# EAGLE design Irdroid-Rpi (EAGLE 6.5.0)
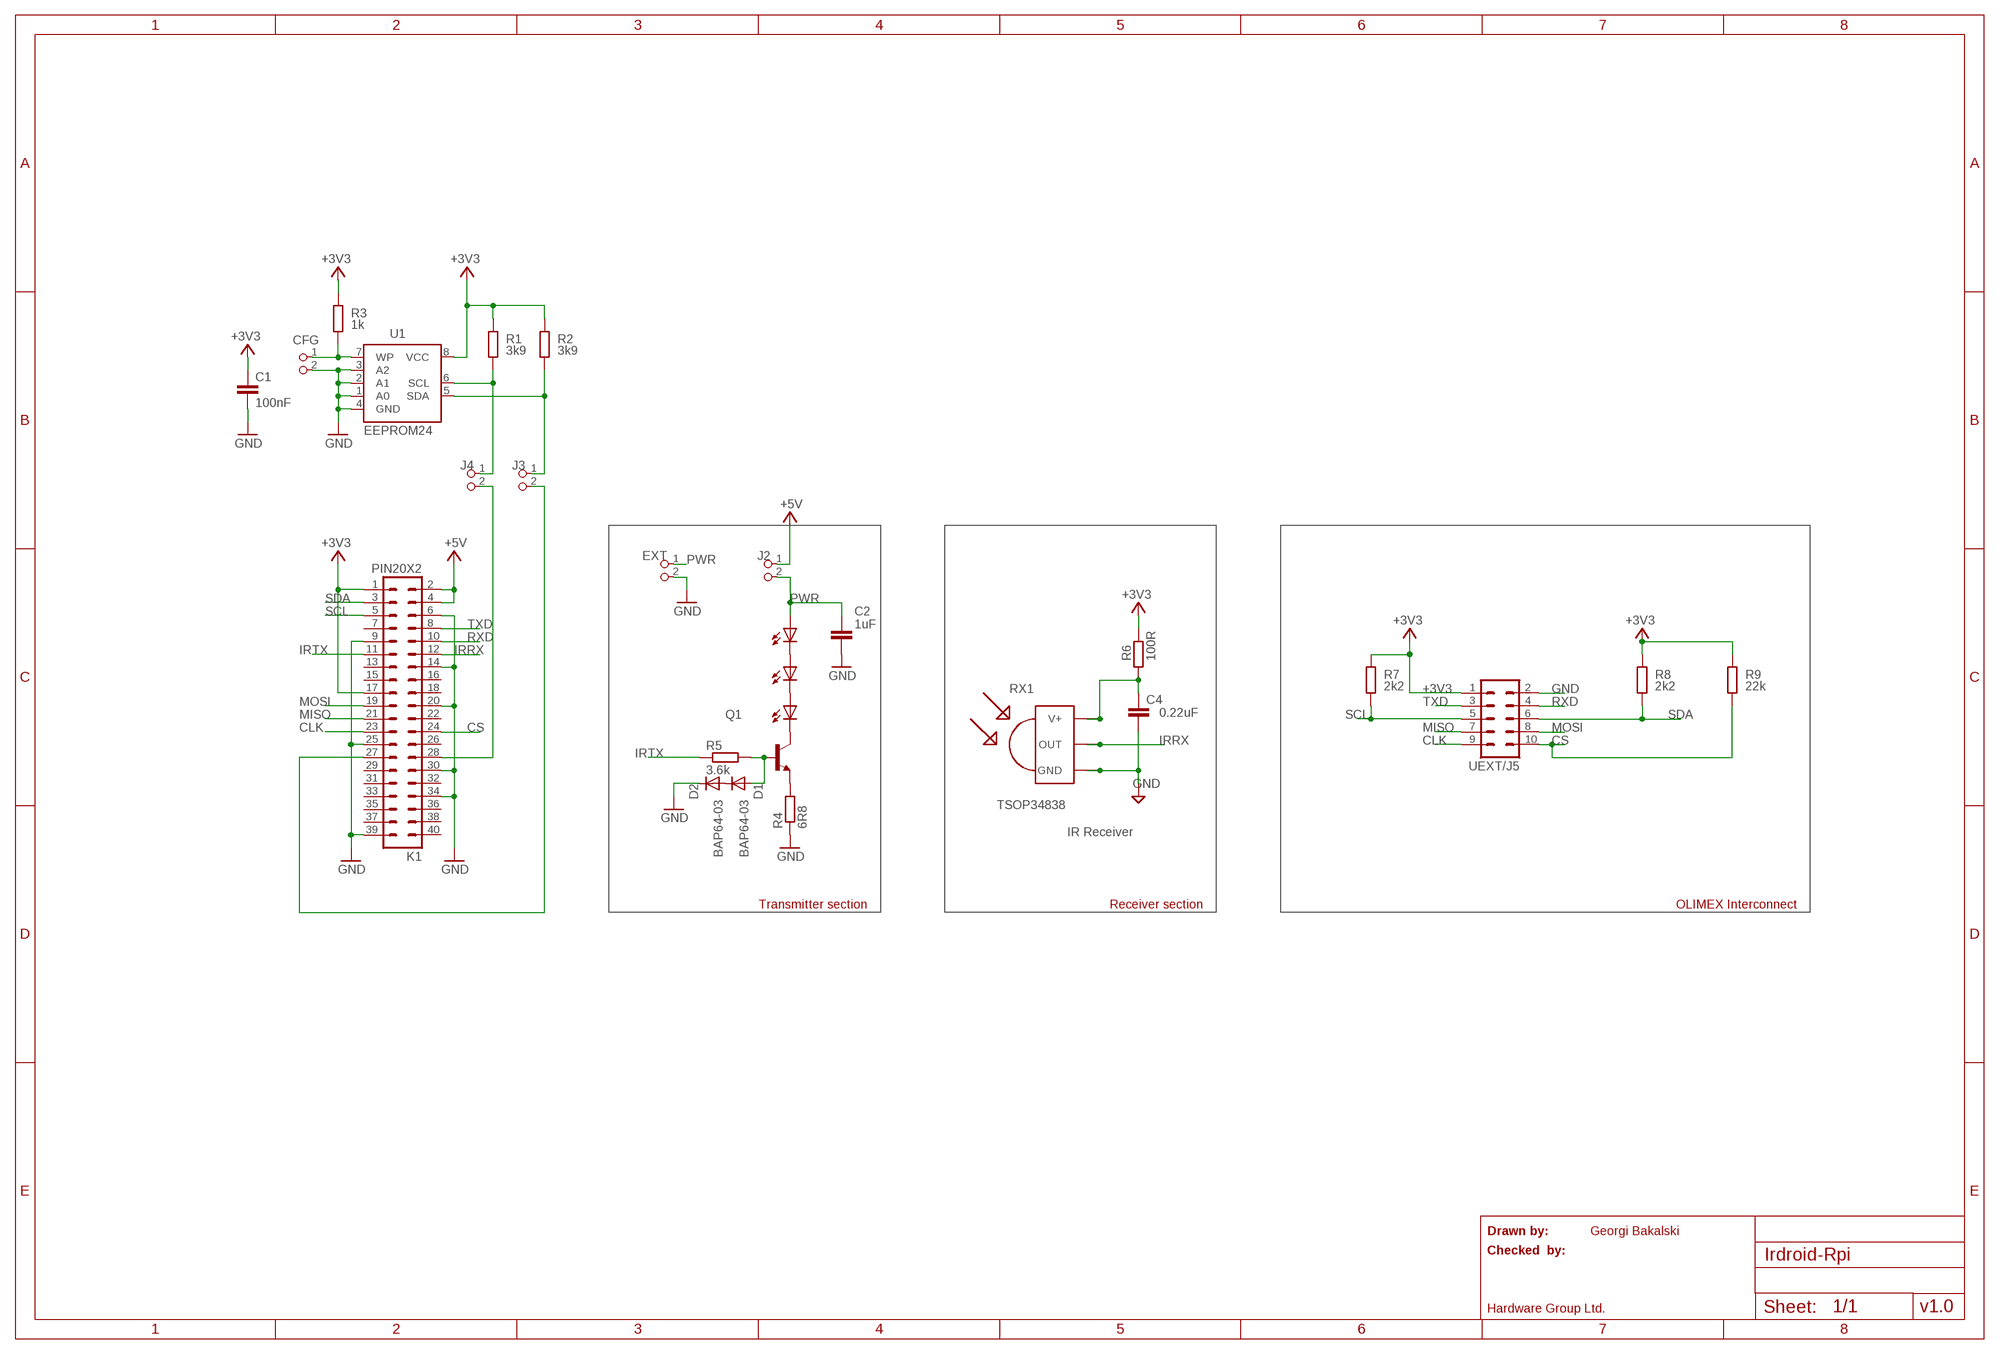
[diagram p0: schematic, sheet 1]

## Parts
C1  100nF  C-EUC0805K  [C0805K]
C2  1uF  CAPACITOR_NPOL-0603  [C603@1]
C4  0.22uF  CAPC603  [C603]
CFG  PIN2_100  [PIN_W_2]
D1  BAP64-03  DIODE-DO323  [DO323]
D2  BAP64-03  DIODE-DO323  [DO323]
EXT  PIN2_100  [PIN_W_2]
J2  PIN2_100  [PIN_W_2]
J3  PIN2_100  [PIN_W_2]
J4  PIN2_100  [PIN_W_2]
K1  PIN20X2  [PIN_20X2]
Q1  TRANSISTOR_BJT_NPN-SOT-23-BCE  [SOT-23]
R1  3k9  R-EU_M0805  [M0805]
R2  3k9  R-EU_M0805  [M0805]
R3  1k  R-EU_M0805  [M0805]
R4  6R8  R-EU_R1206  [R1206]
R5  3.6k  R-EU_R0603  [R0603]
R6  100R  RESISTORR603  [R603]
R7  2k2  R-EU_M0805  [M0805]
R8  2k2  R-EU_M0805  [M0805]
R9  22k  R-EU_M0805  [M0805]
RX1  TSOP34838  TSOP4838  [TSOP18XX]
U1  EEPROM24  [SOIC8]
U$5  IRLED5MM  [IRLED_HOLDER]
U$6  IRLED5MM  [IRLED_HOLDER]
U$7  IRLED5MM  [IRLED_HOLDER]
UEXT/J5  ML10  [ML10]

## Nets
+3V3: C1.1 K1.1 K1.17 R1.2 R2.2 R3.2 R6.2 R7.2 R8.2 R9.2 U1.8(VCC) UEXT/J5.1
+5V: J2.1 K1.2 K1.4
CLK: K1.23 UEXT/J5.9
CS: K1.24 R9.1 UEXT/J5.10
GND: C1.2 C2.2 C4.2 CFG.2 D2.C EXT.2 K1.6 K1.9 K1.14 K1.20 K1.25 K1.30 K1.34 K1.39 R4.1 RX1.GND U1.1(A0) U1.2(A1) U1.3(A2) U1.4(GND) UEXT/J5.2
IRRX: K1.12 RX1.OUT
IRTX: K1.11 R5.1
MISO: K1.21 UEXT/J5.7
MOSI: K1.19 UEXT/J5.8
N$1: J4.2 K1.28
N$2: J3.2 K1.27
N$3: CFG.1 R3.1 U1.7(WP)
N$4: Q1.3(E) R4.2
N$5: Q1.2(C) U$5.K(C)
N$6: U$5.A U$6.K(C)
N$7: U$6.A U$7.K(C)
N$8: D1.A Q1.1(B) R5.2
N$9: D1.C D2.A
N$10: C4.1 R6.1 RX1.VCC(V+)
N$12: J4.1 R1.1 U1.6(SCL)
N$13: J3.1 R2.1 U1.5(SDA)
PWR: C2.1 EXT.1 J2.2 U$7.A
RXD: K1.10 UEXT/J5.4
SCL: K1.5 R7.1 UEXT/J5.5
SDA: K1.3 R8.1 UEXT/J5.6
TXD: K1.8 UEXT/J5.3
Unconnected: K1.7 K1.13 K1.15 K1.16 K1.18 K1.22 K1.26 K1.29 K1.31 K1.32 K1.33 K1.35 K1.36 K1.37 K1.38 K1.40

## Notes on the sheet
- RX1
- TSOP34838
- IR Receiver
- Transmitter section | Receiver section | OLIMEX Interconnect
- Drawn by: | Georgi Bakalski
- Checked  by:
- Hardware Group Ltd. | v1.0

## Library data of the parts
C1 = resistor:C-EU: CAPACITOR, European symbol; DIELECTRIC: X7R
C2 = dp_devices:CAPACITOR_NPOL: Non-Polarized capacitor in various packages
C4 = dp_devices:CAP
CFG EXT J2-J4 = FLYFISH:PIN2
D1 D2 = dp_devices:DIODE: Various Diode Packages
K1 = FLYFISH:PIN20X2
Q1 = dp_devices:TRANSISTOR_BJT_NPN: Most commonly used is SOT23-BEC
R1-R3 R7-R9 = resistor:R-EU_: RESISTOR, European symbol; TOLERANCE: 5%
R4 R5 = resistor:R-EU_: RESISTOR, European symbol
R6 = dp_devices:RESISTOR
RX1 = tsop:TSOP4838: IR Receiver and Demodulator
U1 = FLYFISH:EEPROM24
U$5-U$7 = IRLED_holder:IRLED5MM
UEXT/J5 = con-harting-ml:ML10: HARTING

## Board
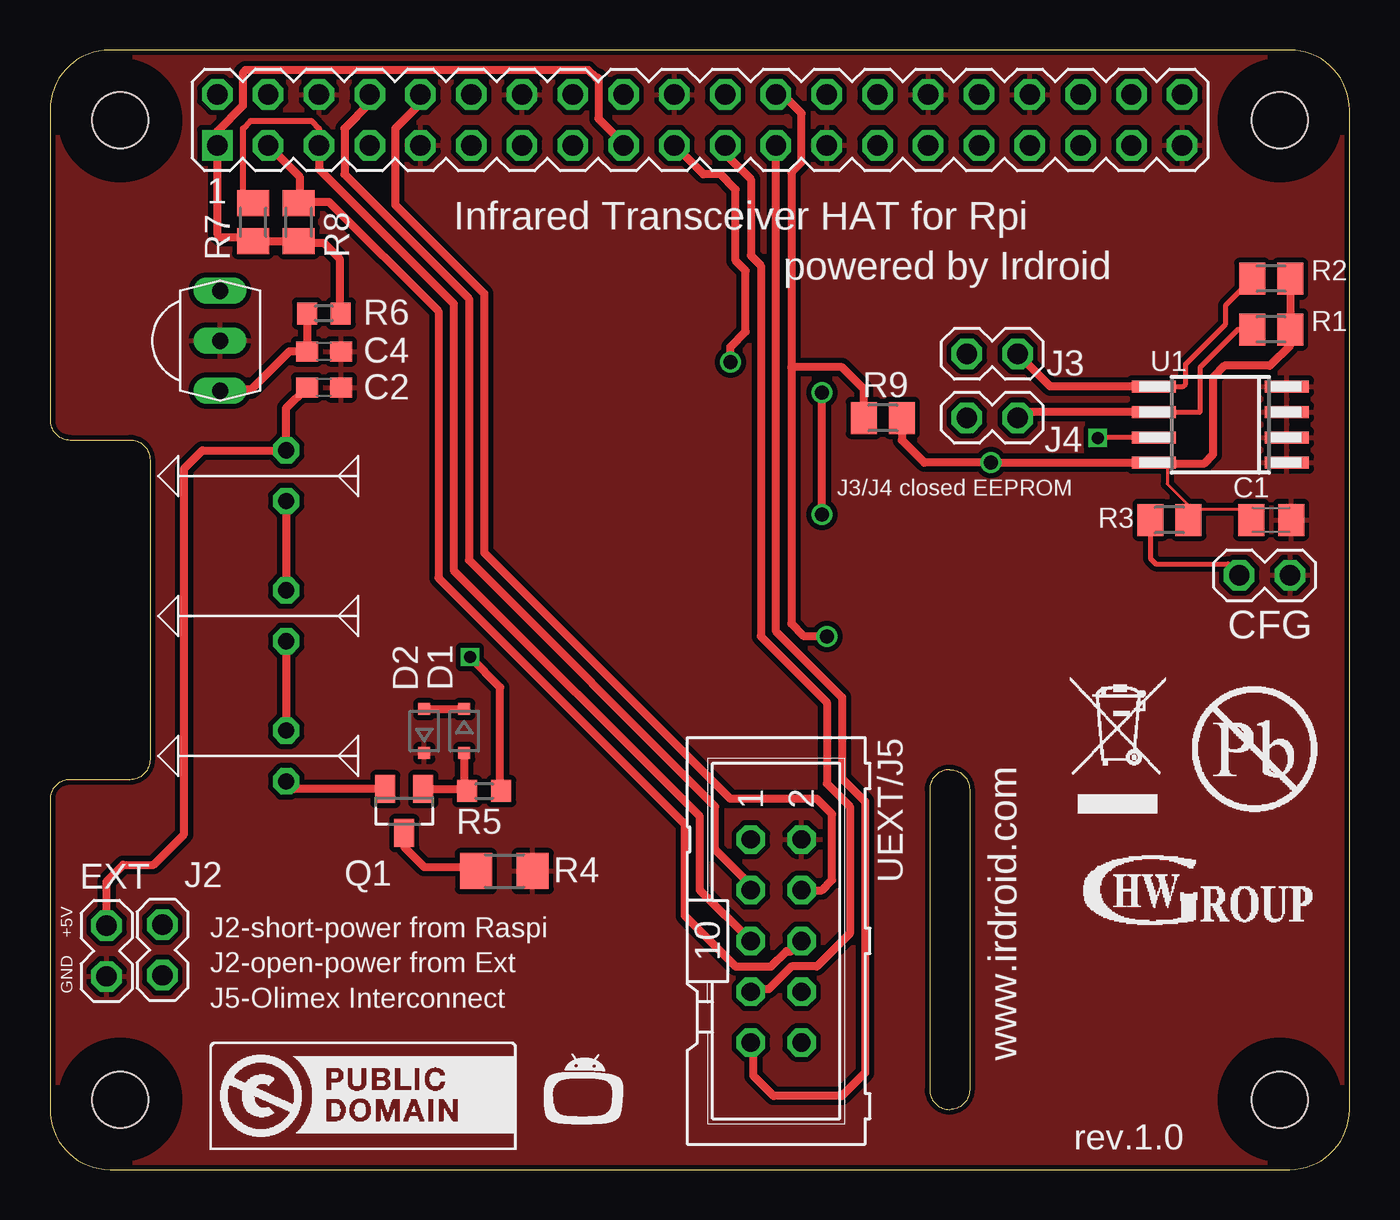
[diagram p1: board, top side]
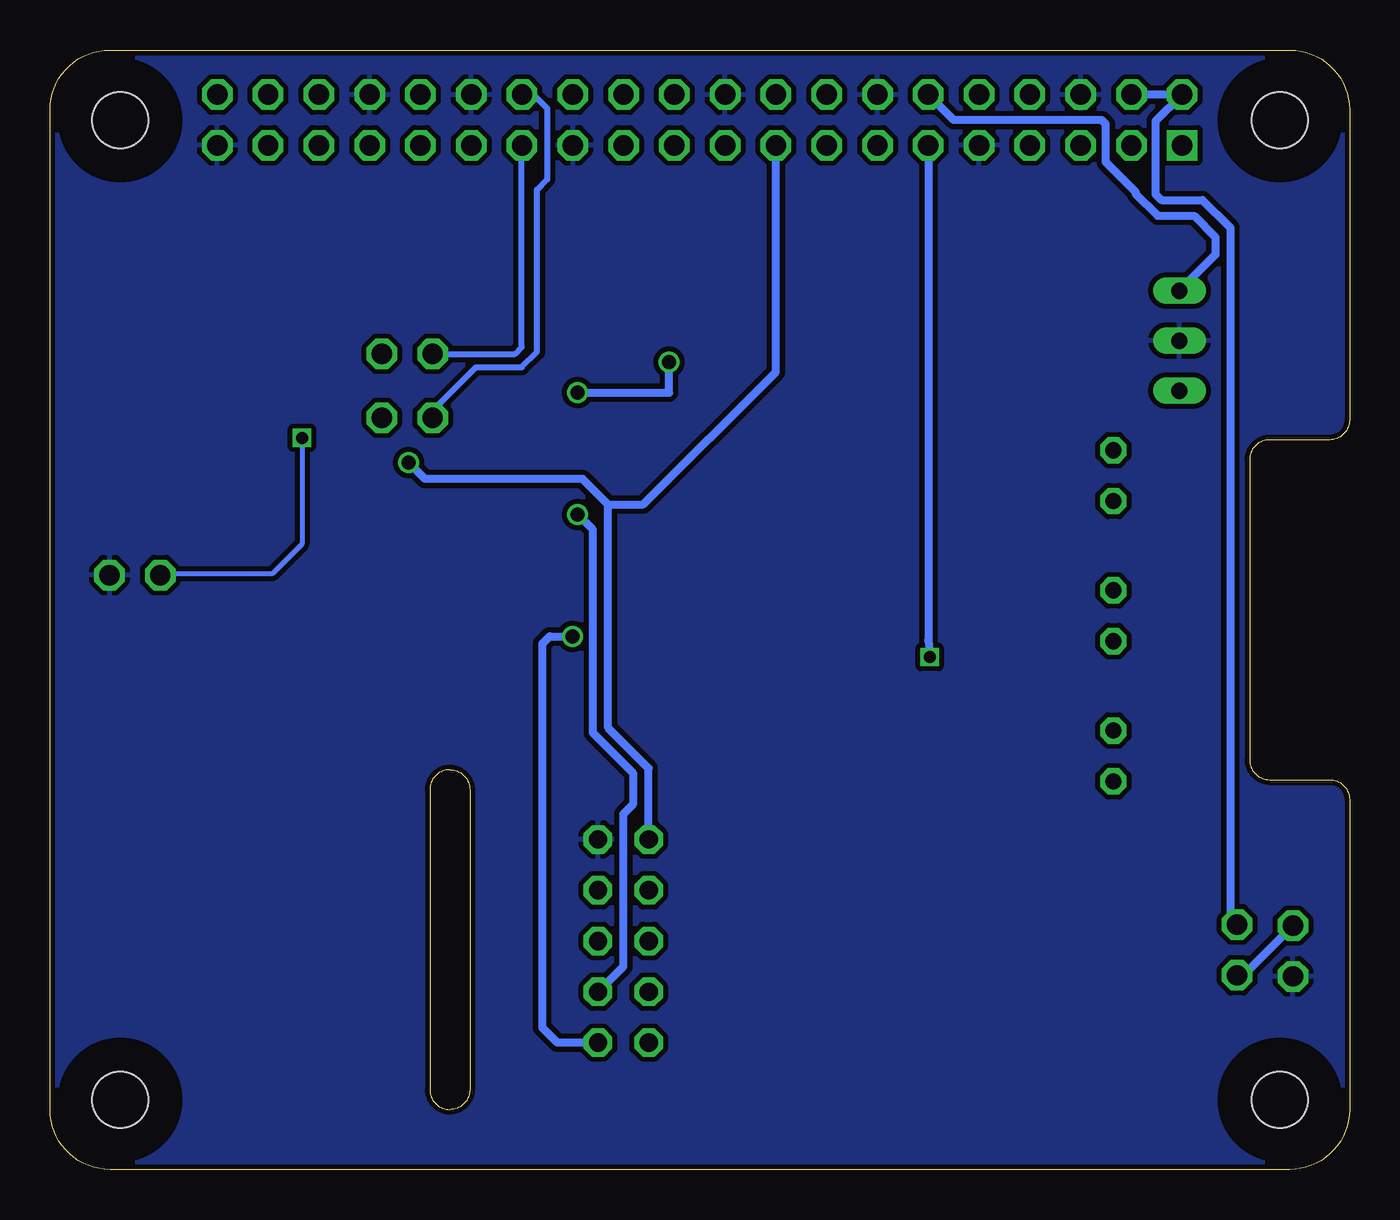
[diagram p2: board, bottom side, seen from below]

Size 65 x 56 mm. Coordinates in mm from the lower left corner, seen from the top.
Outline: 0,3 arc90 3,0 62,0 arc90 65,3 65,53 arc90 62,56 3,56 arc90 0,53 0,37.5 arc90 1,36.5 4,36.5 arc-90 5,35.5 5,20.5 arc-90 4,19.5 1,19.5 arc90 0,18.5 0,3
Outline: 44,19 44,4 arc90 45,3 arc90 46,4 46,19 arc90 45,20 arc90 44,19
Copper layers (1*16): Top 0.035mm / dielectric 1.5mm / Bottom 0.035mm
Design rules "ITEADstudio_DRC *": minimum track width 6mil, minimum drill 12mil, track to track 10mil, track to pad 10mil, pad to pad 10mil, via to via 10mil, smd to smd 0mil, copper to edge 10mil, drill to drill 10mil, minimum pad ring 10mil, minimum via ring 6mil, stop-mask expansion 2mil, vias tented up to drill 100mil, thermal gap 10mil
Holes 2.8 mm at 3.5,3.5 3.5,52.5 61.5,52.5 61.5,3.5
tRestrict: area 1.9,51 to 5,54; area 60,51 to 63,54; area 60,1.9 to 63,5; area 1.9,1.9 to 5,5
bRestrict: area 1.9,1.9 to 5,5; area 1.9,51 to 5,54; area 60,1.9 to 63,5; area 60,51 to 63,54
Milling: 6 lines

### Footprints (pad centres in the part's own frame; a part is rotated, then mirrored left to right if it is on the bottom)
C0805K = smd 1.3 x 1.6: 1 -1,0; 2 1,0
C603@1 = smd 1.1 x 1: 1 -0.85,0; 2 0.85,0
C603 = smd 1.1 x 1: 1 -0.85,0; 2 0.85,0
PIN_W_2 = drill 1.016 octagon: 1 0,0; 2 0,-2.54
DO323 = smd 0.6 x 0.6: A 1.1,0; C -1.1,0
PIN_20X2 = drill 1.016 square: 1 -24.13,-1.27 | drill 1.016 octagon: 2 -24.13,1.27; 3 -21.59,-1.27; 4 -21.59,1.27; 5 -19.05,-1.27; 6 -19.05,1.27; 7 -16.51,-1.27; 8 -16.51,1.27; 9 -13.97,-1.27; 10 -13.97,1.27; 11 -11.43,-1.27; 12 -11.43,1.27; 13 -8.89,-1.27; 14 -8.89,1.27; 15 -6.35,-1.27; 16 -6.35,1.27; 17 -3.81,-1.27; 18 -3.81,1.27; 19 -1.27,-1.27; 20 -1.27,1.27; 21 1.27,-1.27; 22 1.27,1.27; 23 3.81,-1.27; 24 3.81,1.27; 25 6.35,-1.27; 26 6.35,1.27; 27 8.89,-1.27; 28 8.89,1.27; 29 11.43,-1.27; 30 11.43,1.27; 31 13.97,-1.27; 32 13.97,1.27; 33 16.51,-1.27; 34 16.51,1.27; 35 19.05,-1.27; 36 19.05,1.27; 37 21.59,-1.27; 38 21.59,1.27; 39 24.13,-1.27; 40 24.13,1.27
SOT-23 = smd 1 x 1.4: 1 -0.95,-1.1; 2 0.95,-1.1; 3 0,1.1
M0805 = smd 1.3 x 1.6: 1 -0.95,0; 2 0.95,0
R1206 = smd 1.6 x 1.803: 1 -1.422,0; 2 1.422,0
R0603 = smd 1 x 1.1: 1 -0.85,0; 2 0.85,0
R603 = smd 1 x 1.1: 1 -0.85,0; 2 0.85,0
TSOP18XX = drill 0.813 long: GND -0.001,-0.027; OUT -2.501,-0.027; VCC 2.499,-0.027
SOIC8 = smd 0.6 x 2.2: 1 -1.905,-3.33; 2 -0.635,-3.33; 3 0.635,-3.33; 4 1.905,-3.33; 5 1.905,3.33; 6 0.635,3.33; 7 -0.635,3.33; 8 -1.905,3.33
IRLED_HOLDER = drill 0.813 octagon: A 5.41,4.28; K 5.41,1.74
ML10 = drill 0.914 octagon: 1 -5.08,-1.27; 2 -5.08,1.27; 3 -2.54,-1.27; 4 -2.54,1.27; 5 0,-1.27; 6 0,1.27; 7 2.54,-1.27; 8 2.54,1.27; 9 5.08,-1.27; 10 5.08,1.27

### Placement (x,y rotation side)
C1  61.08,32.5 0 top
C2  13.7,39.12 0 top
C4  13.7,40.92 0 top
CFG  59.48,29.73 90 top
D1  20.72,21.93 270 top
D2  18.72,21.93 90 top
EXT  2.83,12.2 0 top
J2  5.62,12.26 0 top
J3  48.4,40.8 270 top
J4  48.4,37.6 270 top
K1  32.5,52.5 0 top
Q1  17.72,17.93 180 top
R1  61.08,42.02 0 top
R2  61.08,44.56 0 top
R3  55.99,32.5 0 top
R4  22.72,14.93 180 top
R5  21.72,18.93 180 top
R6  13.7,42.82 0 top
R7  10.16,47.4 270 top
R8  12.45,47.4 270 top
R9  41.66,37.59 0 top
RX1  8.53,41.45 270 top
U1  58.53,37.26 90 top
U$1  [LOGO_CC-0]  8,1 0 top
U$2  [IRDROIDLOGO]  24.4,2 0 top
U$3  [TRASH]  51.4,17.79 0 top
U$4  [HWGROUP]  51.41,11.79 0 top
U$5  6.4,17.68 0 top
U$6  6.4,24.69 0 top
U$7  6.4,31.7 0 top
UEXT/J5  36.32,11.43 270 top

### Tracks (layer width: path | path; a pad name or v marks a point on that pad's centre or on a via)
+3V3  (via drill 0.7)
  Top 0.152: 57.15,33.02 59.69,33.02 C1.1 | 57.15,33.02 55.88,34.29 55.88,35.56 U1.8 | 57.15,33.02 R3.2
  Top 0.406: K1.17 28.69,51.31 27.43,52.57 27.43,54.61 27.3,54.61 26.92,54.99 9.78,54.99 9.64,54.85 9.64,53.2 8.38,51.94 8.38,51.24 K1.1 8.37,46.8 8.53,46.63 9.97,46.63 R7.2 | 55.75,35.3 57.7,35.3 58.17,35.77 58.17,39.62 58.74,40.2 61,40.2 62.02,41.23 R1.2 R2.2 | 55.75,35.3 55.26,35.3 U1.8 | R9.2 42.61,36.48 43.73,35.36 v47.06,35.36 55.69,35.36 55.75,35.3 | R7.2 R8.2 12.56,46.33 13.72,46.33 14.48,45.57 14.48,42.9 R6.2 | R7.2 10.16,46.25
  Bottom 0.406: K1.17 28.7,39.9 35.33,33.27 37.08,33.27 | UEXT/J5.1 35.05,20.07 37.08,22.1 37.08,33.27 | 37.08,33.27 38.35,34.54 46.24,34.54 v47.06,35.36
+5V
  Bottom 0.406: K1.4 K1.2 9.69,52.45 9.69,48.77 9.42,48.5 7.36,48.5 5.96,47.1 5.96,12.59 J2.1
CLK
  Top 0.406: K1.23 36.32,51.22 36.32,26.92 39.62,23.62 39.62,19.56 40.77,18.41 40.77,4.83 39.62,3.68 36.2,3.68 35.18,4.7 35.18,6.22 UEXT/J5.9
CS  (via drill 0.7)
  Top 0.406: K1.24 36.65,53.77 37.59,52.83 37.59,50.39 37.08,49.89 37.08,40.13 | 37.08,40.13 37.08,27.3 37.72,26.67 v38.86,26.67 | R9.1 40.71,39.05 39.62,40.13 37.08,40.13
  Bottom 0.406: UEXT/J5.10 39.62,6.35 40.39,7.11 40.39,26.29 40.01,26.67 v38.86,26.67
GND
  pour Bottom: 0,3 arc90 3,0 62,0 arc90 65,3 65,53 arc90 62,56 3,56 arc90 0,53 0,37.5 arc90 1,36.5 4,36.5 arc-90 5,35.5 5,20.5 arc-90 4,19.5 1,19.5 arc90 0,18.5
  pour Top: 0,3 arc90 3,0 62,0 arc90 65,3 65,53 arc90 62,56 3,56 arc90 0,53 0,37.5 arc90 1,36.5 4,36.5 arc-90 5,35.5 5,20.5 arc-90 4,19.5 1,19.5 arc90 0,18.5
IRRX
  Bottom 0.406: K1.12 19.8,52.5 12.4,52.5 12.2,52.3 12.2,50.4 10.7,48.9 10.7,48.8 9.6,47.7 7.77,47.7 6.71,46.63 6.71,45.76 RX1.OUT
IRTX  (via drill 0.6)
  Top 0.406: R5.1 22.52,18.93 22.52,24.11 v21,25.64
  Bottom 0.406: K1.11 21.07,26.47 v21,25.64
MISO
  Top 0.406: K1.21 33.77,50.81 35.05,49.53 35.05,45.72 35.56,45.21 35.56,26.67 38.86,23.37 38.86,19.3 40.01,18.16 40.01,11.81 38.35,10.16 37.08,10.16 35.94,9.02 35.18,9.02 UEXT/J5.7
MOSI  (via drill 0.7)
  Top 0.406: v38.61,32.77 v38.61,38.86 | K1.19 32.68,49.78 33.53,49.78 34.29,49.02 34.29,45.47 34.8,44.96 34.8,41.91 34.04,41.15 v34.04,40.39
  Bottom 0.406: UEXT/J5.8 36.32,10.16 36.32,17.78 35.81,18.29 35.81,19.81 37.85,21.84 37.85,32 v38.61,32.77 | v38.61,38.86 34.04,38.86 v34.04,40.39
N$1
  Bottom 0.305: K1.28 40.82,53.77 40.13,53.09 40.13,49.53 40.64,49.02 40.64,40.89 41.4,40.13 43.69,40.13 45.86,37.96 J4.2
N$2
  Bottom 0.305: J3.2 41.75,40.8 41.4,41.15 41.4,51.22 K1.27
N$3  (via drill 0.6)
  Top 0.254: U1.7 52.42,36.62 v52.4,36.6 | R3.1 55.05,30.55 55.3,30.3 58.91,30.3 CFG.1
  Bottom 0.254: v52.4,36.6 52.4,31.3 53.9,29.8 59.41,29.8 CFG.1
N$4
  Top 0.406: Q1.3 17.72,16.13 18.72,15.13 21.1,15.13 R4.2
N$5
  Top 0.406: Q1.2 12.2,19.03 U$5.K
N$6
  Top 0.406: U$6.K U$5.A
N$7
  Top 0.406: U$7.K U$6.A
N$8
  Top 0.406: Q1.1 20.77,19.03 R5.2 20.72,19.08 D1.A
N$9
  Top 0.406: D2.A D1.C
N$10
  Top 0.406: R6.1 C4.1 11.97,40.92 10.06,39.01 8.57,39.01 RX1.VCC
N$12
  Top 0.254: U1.6 57.53,37.9 57.53,40.13 59.44,42.04 60.11,42.04 R1.1
  Top 0.406: U1.6 48.7,37.9 J4.1
N$13
  Top 0.254: U1.5 56.66,39.16 56.8,39.3 56.8,40.3 58.8,42.3 58.8,43.24 R2.1
  Top 0.406: U1.5 50.03,39.16 J3.1
PWR
  Top 0.406: EXT.1 2.83,14.41 3.66,15.24 5.18,15.24 6.71,16.76 6.71,35.05 7.62,35.97 11.8,35.97 U$7.A 11.81,38.09 C2.1
  Bottom 0.406: J2.2 5.31,9.72 EXT.1
RXD
  Top 0.406: K1.10 18.53,53.33 17.27,52.07 17.27,48.26 21.72,43.81 21.72,30.86 34.04,18.54 38.35,18.54 39.12,17.78 39.12,14.48 38.61,13.97 UEXT/J5.4
SCL
  Top 0.305: K1.5 13.46,51.24 13.46,52.07 13.08,52.45 10.03,52.45 9.65,52.07 9.65,48.35 R7.1
  Top 0.406: K1.5 13.45,50.05 20.19,43.31 20.19,29.97 32.51,17.65 32.51,13.97 UEXT/J5.5
SDA
  Top 0.406: UEXT/J5.6 37.08,10.92 36.83,10.92 36.07,10.16 34.29,10.16 31.75,12.7 31.75,17.27 19.43,29.59 19.43,42.93 13.95,48.41 12.51,48.41 | 12.51,48.41 R8.1 | 12.51,48.41 12.51,49.63 K1.3
TXD
  Top 0.406: K1.8 15.99,53.33 14.73,52.07 14.73,49.78 20.95,43.56 20.95,30.48 33.27,18.16 33.27,16 35.05,14.22 UEXT/J5.3

### Text on the board
tNames: Infrared Transceiver HAT for Rpi | powered by Irdroid | J3/J4 closed EEPROM | www.irdroid.com | +5V | J2-short-power from Raspi | J2-open-power from Ext | GND | J5-Olimex Interconnect | rev.1.0